# EAGLE design spotlight (EAGLE 9.6.2)
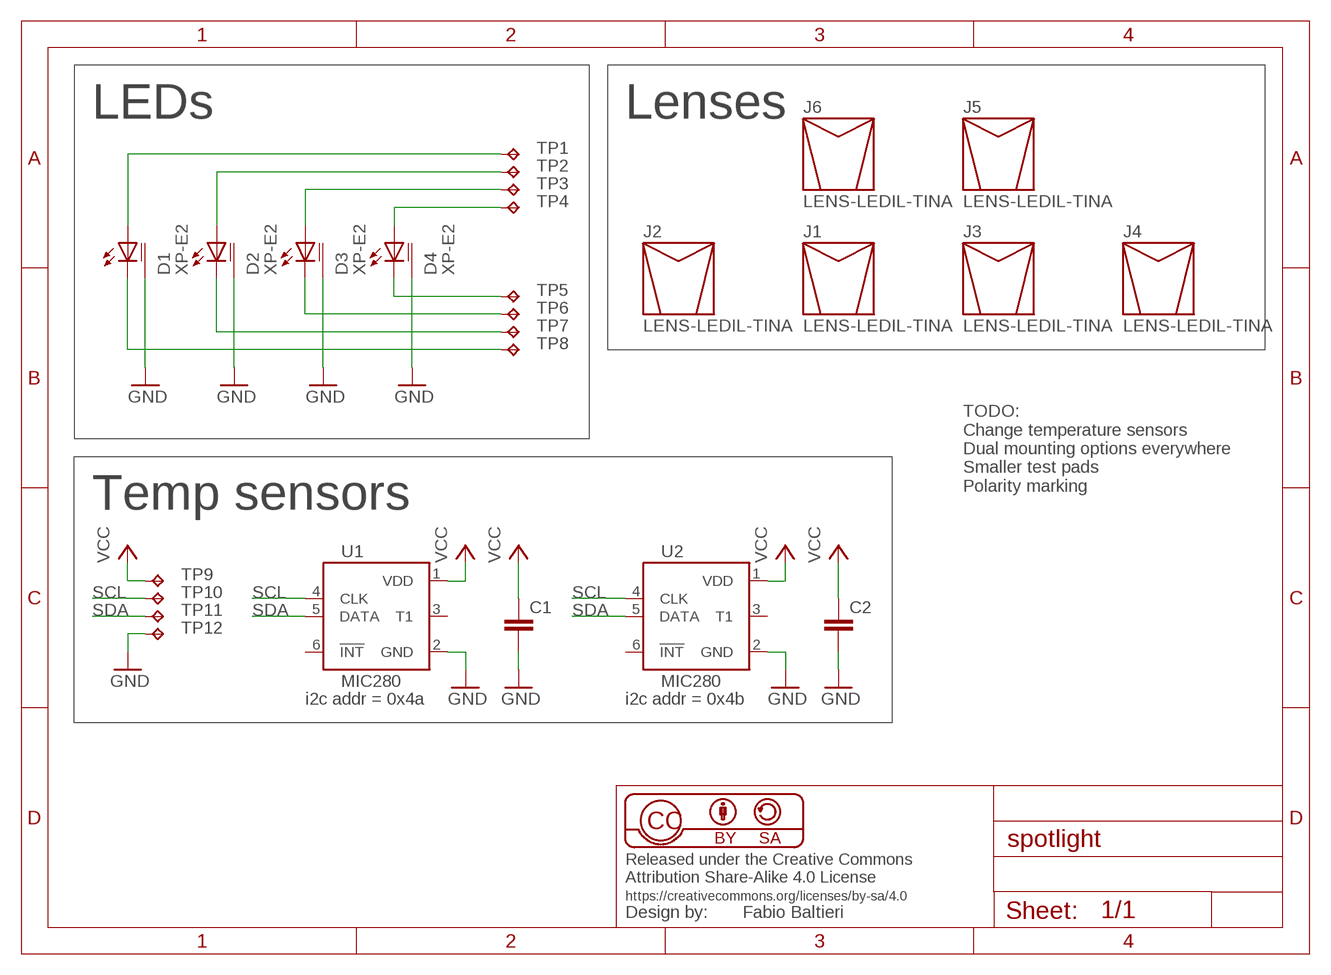
[diagram p0: schematic, sheet 1]

## Parts
C1  C0603  [0603]
C2  C0603  [0603]
D1  XP-E2  LED_CREE-XP-E  [CREE_XPE]
D2  XP-E2  LED_CREE-XP-E  [CREE_XPE]
D3  XP-E2  LED_CREE-XP-E  [CREE_XPE]
D4  XP-E2  LED_CREE-XP-E  [CREE_XPE]
J1  LENS-LEDIL-TINA  [LEDIL-TINA]
J2  LENS-LEDIL-TINA  [LEDIL-TINA]
J3  LENS-LEDIL-TINA  [LEDIL-TINA]
J4  LENS-LEDIL-TINA  [LEDIL-TINA]
J5  LENS-LEDIL-TINA  [LEDIL-TINA]
J6  LENS-LEDIL-TINA  [LEDIL-TINA]
TP1  TPTP18R  [TP18R]
TP2  TPTP18R  [TP18R]
TP3  TPTP18R  [TP18R]
TP4  TPTP18R  [TP18R]
TP5  TPTP18R  [TP18R]
TP6  TPTP18R  [TP18R]
TP7  TPTP18R  [TP18R]
TP8  TPTP18R  [TP18R]
TP9  TPTP14R  [TP14R]
TP10  TPTP14R  [TP14R]
TP11  TPTP14R  [TP14R]
TP12  TPTP14R  [TP14R]
U1  MIC280  [SOT23-6L]
U2  MIC280  [SOT23-6L]

## Nets
GND: C1.2 C2.2 D1.TH D2.TH D3.TH D4.TH TP12.TP U1.2(GND) U2.2(GND)
N$1: D4.K(C) TP5.TP
N$2: D3.K(C) TP6.TP
N$3: D2.K(C) TP7.TP
N$4: D1.K(C) TP8.TP
N$5: D4.A TP4.TP
N$6: D3.A TP3.TP
N$7: D2.A TP2.TP
N$8: D1.A TP1.TP
SCL: TP10.TP U1.4(CLK) U2.4(CLK)
SDA: TP11.TP U1.5(DATA) U2.5(DATA)
VCC: C1.1 C2.1 TP9.TP U1.1(VDD) U2.1(VDD)
Unconnected: U1.3(T1) U1.6(!INT) U2.3(T1) U2.6(!INT)

## Notes on the sheet
- LEDs | Lenses
- TODO:
  Change temperature sensors
  Dual mounting options everywhere
  Smaller test pads
  Polarity marking
- Temp sensors
- i2c addr = 0x4a | i2c addr = 0x4b

## Library data of the parts
C1 C2 = balto:C: Capacitor
D1-D4 = balto:LED_CREE-XP-E: Cree XLamp XP-E LEDs
J1-J6 = balto:LENS: LED Lens
TP1-TP12 = testpad:TP: Test pad
U1 U2 = balto:MIC280: MIC280 Precision IttyBitty Thermal Supervisor

## Board
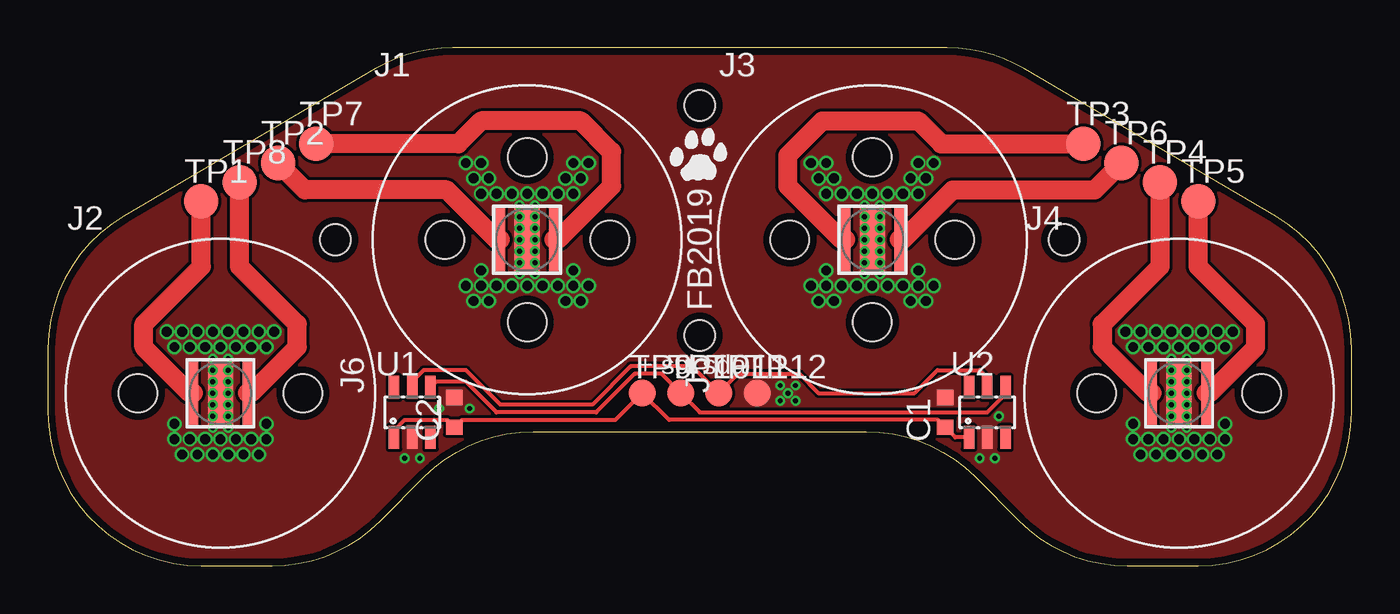
[diagram p1: board, top side]
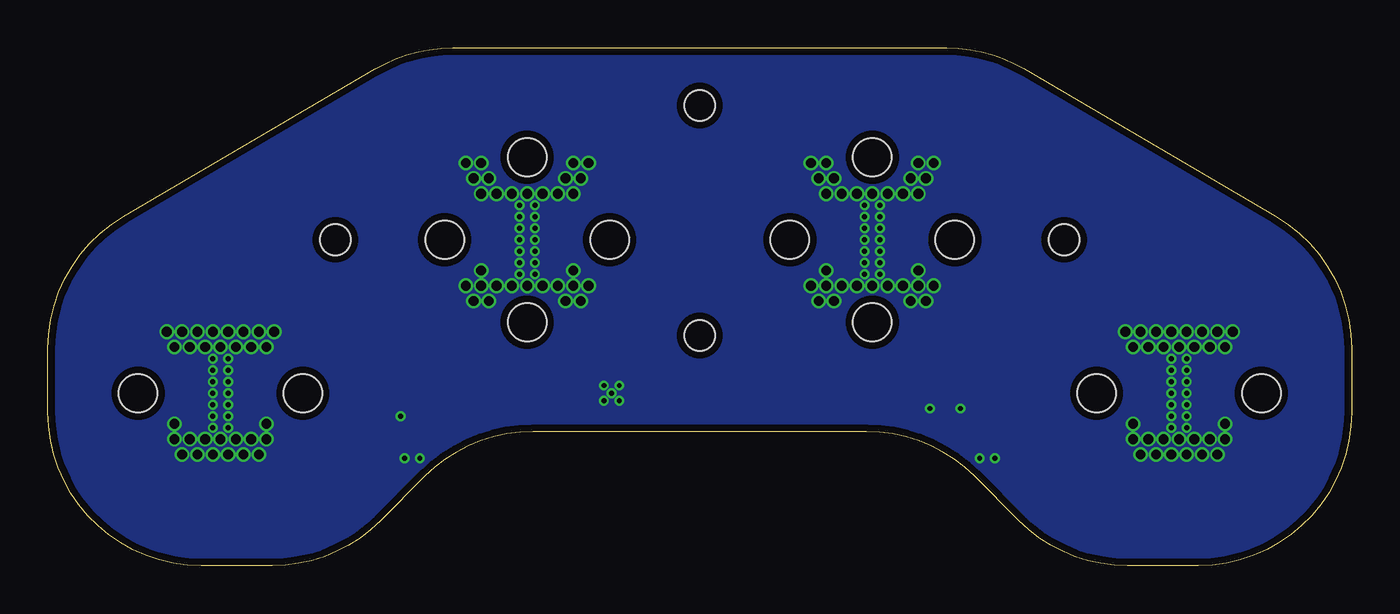
[diagram p2: board, bottom side, seen from below]

Size 68 x 27 mm. Coordinates in mm from the lower left corner, seen from the top.
Outline: 17.06,25.9 3.96,18.23 arc60 0,11.32 0,8 arc90 8,0 11.69,0 arc45 17.34,2.34 19.66,4.66 arc-45 25.31,7 42.69,7 arc-45 48.34,4.66 50.66,2.34 arc45 56.31,0 60,0 arc90 68,8 68,11.32 arc60 64.05,18.23 50.94,25.9 arc30 46.9,27 21.1,27 arc30 17.06,25.9
Copper layers (1*16): Top 0.035mm / dielectric 1.5mm / Bottom 0.035mm
Design rules "balto": minimum track width 6mil, minimum drill 10mil, track to track 6mil, track to pad 6mil, pad to pad 6mil, via to via 6mil, smd to smd 6mil, copper to edge 15mil, drill to drill 5mil, minimum pad ring 5mil, minimum via ring 5mil, stop-mask expansion 2mil, vias tented up to drill 20mil, thermal gap 8mil
Holes 1.6 mm at 34,24 34,12 15,17 53,17

### Footprints (pad centres in the part's own frame; a part is rotated, then mirrored left to right if it is on the bottom)
0603 = smd 0.787 x 0.864: 1 -0.774,0; 2 0.774,0
CREE_XPE = smd 0.5 x 3.3: A -1.4,0; K 1.4,0 | smd 1.3 x 3.3: TH 0,0
LEDIL-TINA = hole 2: -4.3,0; 4.3,0
TP18R = smd 1.8 x 1.8: TP 0,0
TP14R = smd 1.4 x 1.4: TP 0,0
SOT23-6L = smd 0.55 x 1.2: 1 -0.95,-1.3; 2 0,-1.3; 3 0.95,-1.3; 4 0.95,1.3; 5 0,1.3; 6 -0.95,1.3

### Placement (x,y rotation side)
C1  46.8,8 90 top
C2  21.2,8 90 top
D1  9,9 0 top
D2  25,17 0 top
D3  43,17 0 top
D4  59,9 0 top
J1  25,17 0 top
J2  9,9 0 top
J3  43,17 0 top
J4  59,9 0 top
J5  43,17 90 top
J6  25,17 90 top
TP1  8,19 0 top
TP2  12,21 0 top
TP3  54,22 0 top
TP4  58,20 0 top
TP5  60,19 0 top
TP6  56,21 0 top
TP7  14,22 0 top
TP8  10,20 0 top
TP9  31,9 0 top
TP10  33,9 0 top
TP11  35,9 0 top
TP12  37,9 0 top
U1  19,8 0 top
U2  49,8 0 top
U$1  [CAT-L]  34,21 0 top

### Tracks (layer width: path | path; a pad name or v marks a point on that pad's centre or on a via)
GND  (via drill 0.25, 0.51)
  other vias: 6.6,7.4 6.6,6.6 7.4,6.6 7,5.8 8.2,6.6 7.8,5.8 9,6.6 9.8,6.6 10.6,6.6 11.4,6.6 11.4,7.4 8.6,5.8 9.4,5.8 10.2,5.8 11,5.8 8.6,7.2 9.4,7.2 9.4,7.8 8.6,7.8 8.6,8.4 9.4,8.4 9.4,9 8.6,9 8.6,9.6 9.4,9.6 9.4,10.2 8.6,10.2 8.6,10.8 9.4,10.8 6.2,12.2 6.6,11.4 7,12.2 7.4,11.4 7.8,12.2 8.2,11.4 8.6,12.2 9,11.4 9.4,12.2 9.8,11.4 10.2,12.2 10.6,11.4 11,12.2 11.4,11.4 11.8,12.2 22.6,15.4 22.6,14.6 23.4,14.6 23,13.8 24.2,14.6 21.8,14.6 25,14.6 25.8,14.6 26.6,14.6 27.4,14.6 27.4,15.4 22.2,13.8 27.8,13.8 28.2,14.6 27,13.8 24.6,15.2 25.4,15.2 25.4,15.8 24.6,15.8 24.6,16.4 25.4,16.4 25.4,17 24.6,17 24.6,17.6 25.4,17.6 25.4,18.2 24.6,18.2 24.6,18.8 25.4,18.8 21.8,21 22.6,19.4 23,20.2 23.4,19.4 22.6,21 24.2,19.4 22.2,20.2 25,19.4 27.8,20.2 25.8,19.4 28.2,21 26.6,19.4 27,20.2 27.4,19.4 27.4,21 40.6,15.4 40.6,14.6 41.4,14.6 41,13.8 42.2,14.6 39.8,14.6 43,14.6 43.8,14.6 44.6,14.6 45.4,14.6 45.4,15.4 40.2,13.8 45.8,13.8 46.2,14.6 45,13.8 42.6,15.2 43.4,15.2 43.4,15.8 42.6,15.8 42.6,16.4 43.4,16.4 43.4,17 42.6,17 42.6,17.6 43.4,17.6 43.4,18.2 42.6,18.2 42.6,18.8 43.4,18.8 40.6,21 40.6,19.4 41,20.2 41.4,19.4 39.8,21 42.2,19.4 40.2,20.2 43,19.4 45.8,20.2 43.8,19.4 46.2,21 44.6,19.4 45,20.2 45.4,19.4 45.4,21 56.6,7.4 56.6,6.6 57.4,6.6 57,5.8 58.2,6.6 57.8,5.8 59,6.6 59.8,6.6 60.6,6.6 61.4,6.6 61.4,7.4 58.6,5.8 59.4,5.8 60.2,5.8 61,5.8 58.6,7.2 59.4,7.2 59.4,7.8 58.6,7.8 58.6,8.4 59.4,8.4 59.4,9 58.6,9 58.6,9.6 59.4,9.6 59.4,10.2 58.6,10.2 58.6,10.8 59.4,10.8 56.2,12.2 56.6,11.4 57,12.2 57.4,11.4 57.8,12.2 58.2,11.4 58.6,12.2 59,11.4 59.4,12.2 59.8,11.4 60.2,12.2 60.6,11.4 61,12.2 61.4,11.4 61.8,12.2 39,8.6 38.6,9 38.2,8.6 38.2,9.4 39,9.4 49.4,5.6 49.6,7.8 22,8.2 20.4,8.2 18.6,5.6 19.4,5.6 48.6,5.6
  pour Top (no thermals): -1,-1 69,-1 69,28 -1,28
  pour Bottom (no thermals): -2,-2 70,-2 70,29 -2,29
N$1
  Top 1: D4.K 60.6,9 63,11.4 63,12.6 60,15.6 TP5.TP
N$2
  Top 1: D3.K 44.6,17 47.2,19.6 54.6,19.6 TP6.TP
N$3
  Top 1: D2.K 26.6,17 29.4,19.8 29.4,21.6 27.8,23.2 22.6,23.2 21.4,22 TP7.TP
N$4
  Top 1: D1.K 10.6,9 13,11.4 13,12.6 10,15.6 TP8.TP
N$5
  Top 1: D4.A 57.4,9 55,11.4 55,12.6 58,15.6 TP4.TP
N$6
  Top 1: D3.A 41.4,17 38.6,19.8 38.6,21.4 40.4,23.2 45.4,23.2 46.6,22 TP3.TP
N$7
  Top 1: D2.A 23.4,17 20.8,19.6 13.4,19.6 TP2.TP
N$8
  Top 1: D1.A 7.4,9 5,11.4 5,12.6 8,15.6 TP1.TP
SCL
  Top 0.2: U2.4 49.95,8.95 49,8 34,8 TP10.TP 32,10 30.6,10 28.6,8 23.4,8 21.8,9.6 20.25,9.6 U1.4
SDA
  Top 0.2: U2.5 49,9.8 48.6,10.2 46.4,10.2 45.2,9 40.2,9 39.2,10 36,10 TP11.TP 33.6,10.4 30.4,10.4 28.4,8.4 23.6,8.4 21.8,10.2 19.6,10.2 19,9.6 U1.5
VCC
  Top 0.2: U1.1 18.05,7.05 18.6,7.6 20.83,7.6 C2.1 21.23,7.23 21.6,7.6 29.6,7.6 TP9.TP 32.4,7.6 46.42,7.6 C1.1 47.33,6.7 U2.1

### Text on the board
_tsilk: FB2019 | + scl sda -